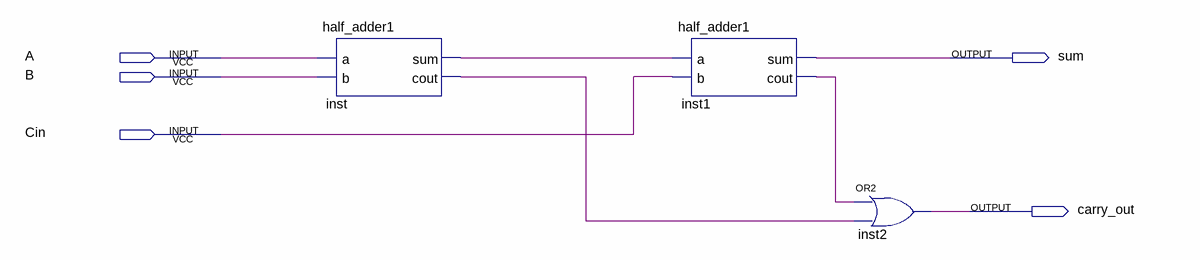
[diagram p0: schematic sheet]
// Quartus schematic halfadderveri.bdf as structural Verilog: 3 symbols, 5 pins
module halfadderveri (
  input  A,
  input  B,
  input  Cin,
  output sum,
  output carry_out
);

  wire inst1_cout, inst_cout, inst_sum;

  half_adder1 inst (.a(A), .b(B), .sum(inst_sum), .cout(inst_cout));
  half_adder1 inst1 (.a(inst_sum), .b(Cin), .sum(sum), .cout(inst1_cout));
  or inst2 (carry_out, inst1_cout, inst_cout);
endmodule
